# Altium schematic sheet Схема электрическая.SchDoc
size A4
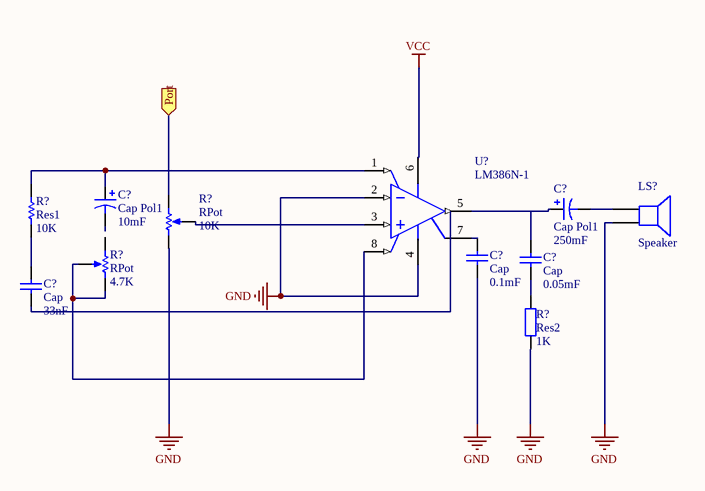
[diagram p0: Схема электрическая.SchDoc]

## Parts
(Parts that share a designator on the sheet are numbered #1, #2 ... from top to bottom, then left to right.)
C?#1  Cap Pol1  value 10mF  [RB7.6-15]
C?#2  Cap Pol1  value 250mF  [RB7.6-15]
C?#3  Cap  value 0.1mF  [RAD-0.3]
C?#4  Cap  value 0.05mF  [RAD-0.3]
C?#5  Cap  value 33nF  [RAD-0.3]
LS?  Speaker  [PIN2]
R?#1  Res1  value 10K  [AXIAL-0.3]
R?#2  RPot  value 10K  [VR5]
R?#3  RPot  value 4.7K  [VR5]
R?#4  Res2  value 1K  [AXIAL-0.4]
U?  LM386N-1  [TI-P8]

## Ports
Port (in)

## Nets
GND: C?#3.1 LS?.2 R?#2.1(TOP) R?#4.1 U?.2(IN-) U?.4(GND)
VCC: U?.6(VS)
Port: R?#2.2(BOT) ; port Port
NetC?#1_1: C?#1.1 R?#1.2 U?.1(GAIN)
NetC?#2_1: C?#2.1 C?#4.2 U?.5(VOUT)
NetC?#2_2: C?#2.2 LS?.1
NetC?#3_2: C?#3.2 U?.7(BYPASS)
NetC?#4_1: C?#4.1 R?#4.2
NetC?#5_2: C?#5.2 R?#1.1
NetR?#2_3: R?#2.3(TAP) U?.3(IN+)
NetR?#3_2: R?#3.2(BOT) R?#3.3(TAP) U?.8(GAIN)

Not connected (* = marked no-connect by the designer): C?#1 2; C?#5 1; R?#3 1(TOP)

## Library data of the parts
C?#1 C?#2 = Cap Pol1: Polarized Capacitor (Radial); Published: 8-Jun-2000; LatestRevisionDate: 17-Jul-2002; LatestRevisionNote: Re-released for DXP Platform.; PackageReference: RB7.6-15; Publisher: Altium Limited; PackageDescription: Polarized Capacitor (Radial); 2 Leads
C?#3-C?#5 = Cap: Capacitor; Published: 8-Jun-2000; LatestRevisionDate: 17-Jul-2002; LatestRevisionNote: Re-released for DXP Platform.; PackageReference: RAD-0.3; Publisher: Altium Limited; PackageDescription: Radial Cap, Thru-Hole; 2 Leads; 0.3 in Pin Spacing
LS? = Speaker: Loudspeaker; Published: 24-Mar-1999; LatestRevisionDate: 17-Jul-2002; LatestRevisionNote: Re-released for DXP Platform.; PackageReference: PIN2; Publisher: Altium Limited
R?#1 = Res1: Resistor; Published: 8-Jun-2000; LatestRevisionDate: 17-Jul-2002; LatestRevisionNote: Re-released for DXP Platform.; PackageReference: AXIAL-0.3; Publisher: Altium Limited; PackageDescription: Axial Device, Thru-Hole; 2 Leads; 0.3 in Pin Spacing
R?#2 R?#3 = RPot: Potentiometer; Sim Note: Enter the Resistance value and the set point into parameter fields.; Set Position: 0.5; Published: 8-Jun-2000; LatestRevisionDate: 17-Jul-2002; LatestRevisionNote: Re-released for DXP Platform.; PackageReference: VR5; Publisher: Altium Limited; PackageDescription: Variable Resistor, Thru-Hole; 3 Leads
R?#4 = Res2: Resistor; Published: 8-Jun-2000; LatestRevisionDate: 17-Jul-2002; LatestRevisionNote: Re-released for DXP Platform.; PackageReference: AXIAL-0.4; Publisher: Altium Limited; PackageDescription: Axial Device, Thru-Hole; 2 Leads; 0.4 in Pin Spacing
U? = LM386N-1: Low Voltage Audio Power Amplifier, 0 to 70 degC, 8-pin DIP (P8); Manufacturer: Texas Instruments; Input Type: Analog; Max. Number of Speaker Outputs: 1; SubFamily: Mid/High-Power Amplifier; DatasheetVersion: SNAS545A; PackageVersion: 4040082/E, 04/2010; PackageReference: P8; PackageDescription: 8-Pin Plastic In-Line, Body 9.59 x 6.35 mm, Pitch 2.54 mm; Supplier 1: Digi-Key; Supplier Part Number 1: LM386N-1-ND; Supplier 2: Farnell; Supplier Part Number 2: 9488332; Supplier 3: Newark; Supplier Part Number 3: 92F293; Supplier 4: Mouser; Supplier Part Number 4: 926-LM386N-1; Mounting Technology: Through Hole; Code_JEDEC: MS-001; PartNumber: LM386N-1; ComponentLink1Description: Manufacturer URL; ComponentLink1URL: http://www.ti.com/; ComponentLink2Description: Datasheet; ComponentLink2URL: http://www.ti.com/general/docs/lit/getliterature.tsp?genericPartNumber=LM386&fileType=pdf; ComponentLink3Description: Package Specification; ComponentLink3URL: http://www.ti.com/litv/pdf/mpdi001b